# EAGLE design Crypto_plus_Flash_Adapter_NucleoF767.v2 (EAGLE 9.6.2)
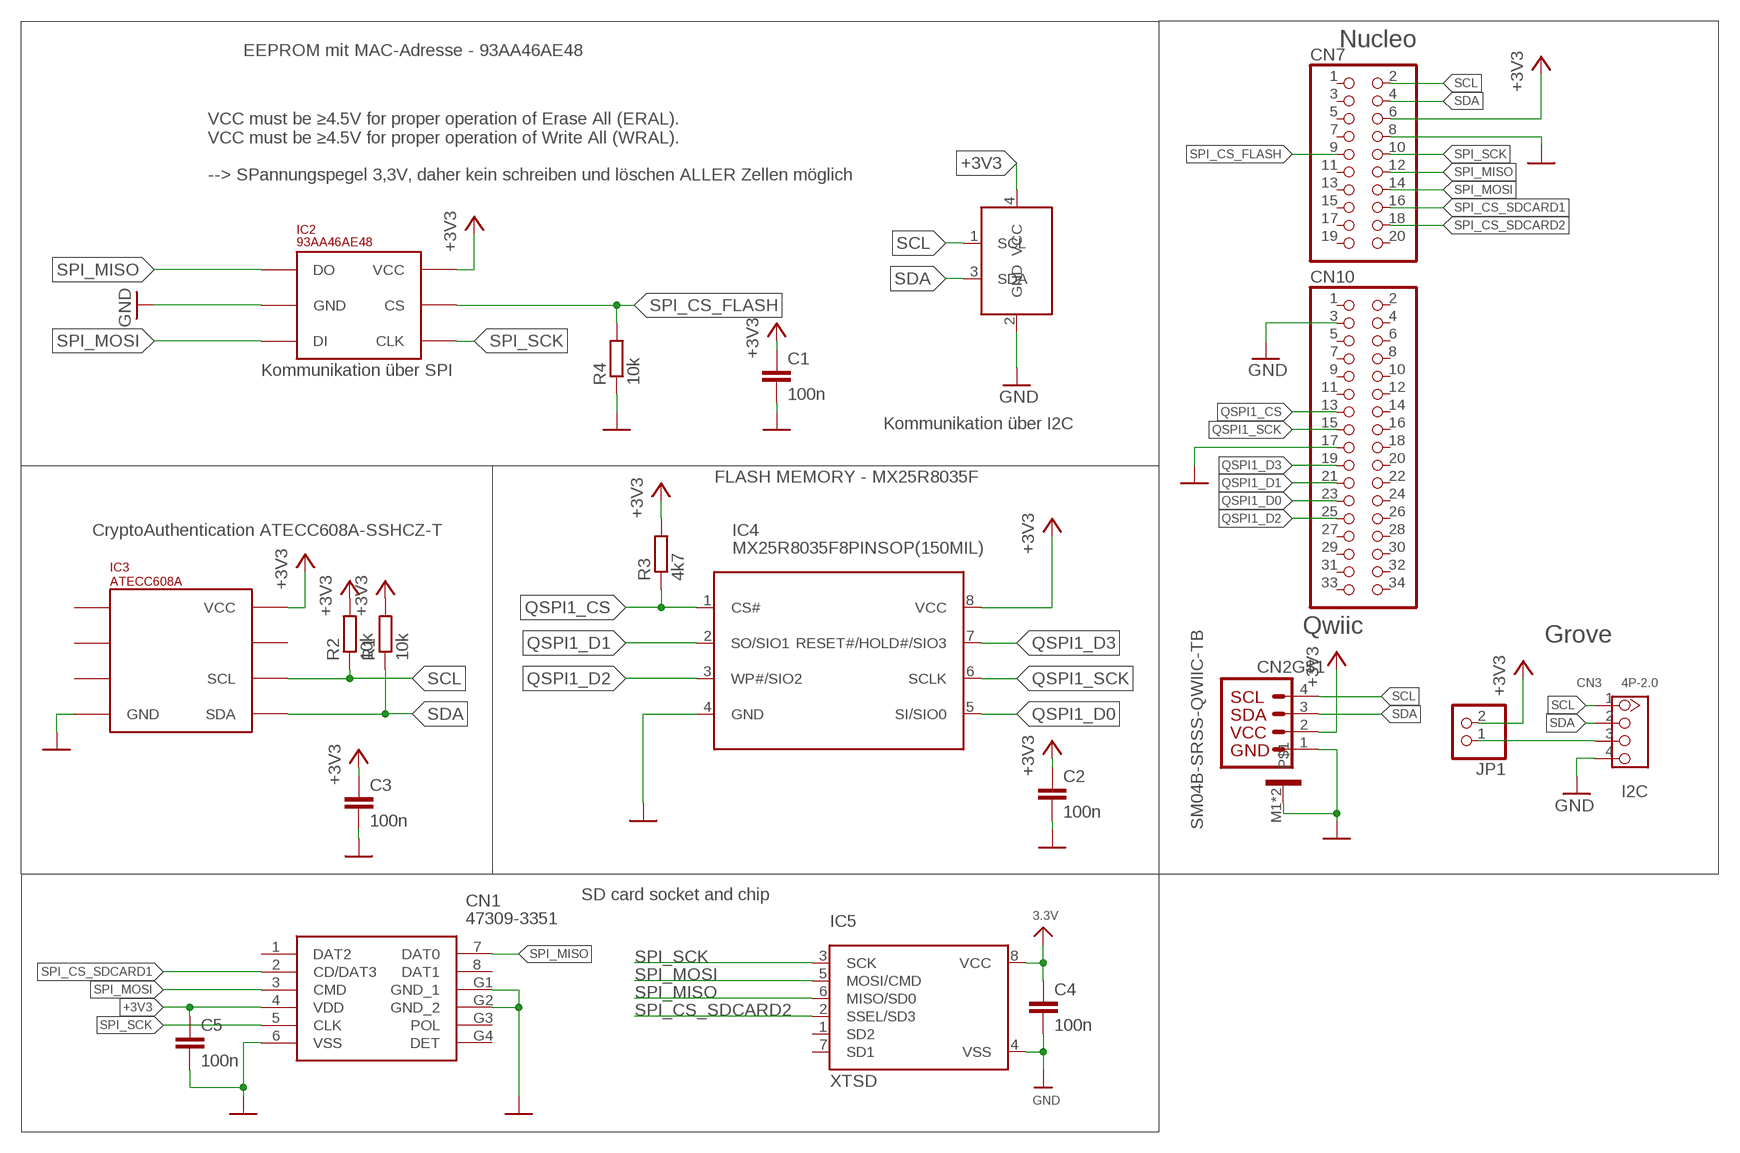
[diagram p0: schematic, sheet 1]

## Parts
C1  100n  C-EUC0603  [C0603]
C2  100n  C-EUC0603  [C0603]
C3  100n  C-EUC0603  [C0603]
C4  100n  C-EUC0603  [C0603]
C5  100n  C-EUC0603  [C0603]
CN1  47309-3351  [473093351]
CN2  SM04B-SRSS-QWIIC-TB  [SM04B-SRSS-TB]
CN3  4P-2.0  GROOVE_THT  [HW4-2.0]
CN7  PINHD-2X10  [2X10]
CN10  PINHD-2X17  [2X17]
IC1  I2CEEPROM_24AA02E48  [SOT23-5L]
IC2  93AA46AE48  [93AA46AE48]
IC3  ATECC608A  [SOIC8]
IC4  MX25R8035F8PINSOP(150MIL)  [SOIC127P600X175-8]
IC5  XTSD  SMT_SDCARD_8PIN  [LGA8_8X6]
JP1  PINHD-1X2  [1X02]
R1  10k  R-EU_R0603  [R0603]
R2  10k  R-EU_R0603  [R0603]
R3  4k7  R-EU_R0603  [R0603]
R4  10k  R-EU_R0603  [R0603]

## Nets
+3V3: C1.1 C2.1 C3.1 C4.1 C5.1 CN1.4(VDD) CN2.2 CN7.6 IC1.4(VCC) IC2.P$6(VCC) IC3.8(VCC) IC4.8(VCC) IC5.8(VCC) JP1.2 R1.2 R2.2 R3.2 ; supply symbol labelled 3.3V
GND: C1.2 C2.2 C3.2 C4.2 C5.2 CN1.6(VSS) CN1.G1(GND_1) CN1.G2(GND_2) CN2.1 CN2.M1 CN2.M2 CN3.4 CN7.8 CN10.17 IC1.2(GND) IC2.P$2(GND) IC3.4(GND) IC4.4(GND) IC5.4(VSS) R4.1
N$1: CN3.3 JP1.1
N$2: CN10.3 ; supply symbol labelled GND
QSPI1_CS: CN10.13 IC4.1(CS#) R3.1
QSPI1_D0: CN10.23 IC4.5(SI/SIO0)
QSPI1_D1: CN10.21 IC4.2(SO/SIO1)
QSPI1_D2: CN10.25 IC4.3(WP#/SIO2)
QSPI1_D3: CN10.19 IC4.7(RESET#/HOLD#/SIO3)
QSPI1_SCK: CN10.15 IC4.6(SCLK)
SCL: CN2.4 CN3.1 CN7.2 IC1.1(SCL) IC3.6(SCL) R2.1
SDA: CN2.3 CN3.2 CN7.4 IC1.3(SDA) IC3.5(SDA) R1.1
SPI_CS_FLASH: CN7.9 IC2.P$5(CS) R4.2
SPI_CS_SDCARD1: CN1.2(CD/DAT3) CN7.16
SPI_CS_SDCARD2: CN7.18 IC5.2(SSEL/SD3)
SPI_MISO: CN1.7(DAT0) CN7.12 IC2.P$1(DO) IC5.6(MISO/SD0)
SPI_MOSI: CN1.3(CMD) CN7.14 IC2.P$3(DI) IC5.5(MOSI/CMD)
SPI_SCK: CN1.5(CLK) CN7.10 IC2.P$4(CLK) IC5.3(SCK)
Unconnected: CN1.1(DAT2) CN1.8(DAT1) CN1.G3(POL) CN1.G4(DET) CN7.1 CN7.3 CN7.5 CN7.7 CN7.11 CN7.13 CN7.15 CN7.17 CN7.19 CN7.20 CN10.1 CN10.2 CN10.4 CN10.5 CN10.6 CN10.7 CN10.8 CN10.9 CN10.10 CN10.11 CN10.12 CN10.14 CN10.16 CN10.18 CN10.20 CN10.22 CN10.24 CN10.26 CN10.27 CN10.28 CN10.29 CN10.30 CN10.31 CN10.32 CN10.33 CN10.34 IC3.1(NC1) IC3.2(NC2) IC3.3(NC3) IC3.7(NC4) IC5.1(SD2) IC5.7(SD1)

## Notes on the sheet
- Nucleo
- EEPROM mit MAC-Adresse - 93AA46AE48
- VCC must be ≥4.5V for proper operation of Erase All (ERAL).
  VCC must be ≥4.5V for proper operation of Write All (WRAL).
  
  --> SPannungspegel 3,3V, daher kein schreiben und löschen ALLER Zellen möglich
- Kommunikation über SPI
- Kommunikation über I2C
- FLASH MEMORY - MX25R8035F
- CryptoAuthentication ATECC608A-SSHCZ-T
- Qwiic
- Grove
- I2C
- SD card socket and chip

## Library data of the parts
C1-C5 = rcl:C-EU: CAPACITOR, European symbol; SPICEPREFIX: C
CN1 = SamacSys_Parts:47309-3351: Molex 47309 Series 8 Way Right Angle Micro SD Memory Card Connector with Solder Termination Source: Datasheet <https://componentsearchengine.com/Datasheets/2/47309-3351.pdf>; DESCRIPTION: Molex 47309 Series 8 Way Right Angle Micro SD Memory Card Connector with Solder Termination; HEIGHT: 3.35mm; MANUFACTURER_NAME: Molex; MANUFACTURER_PART_NUMBER: 47309-3351; MOUSER_PART_NUMBER: 538-47309-3351; MOUSER_PRICE-STOCK: https://www.mouser.co.uk/ProductDetail/Molex/47309-3351/?qs=7KFxWLW3pjpf5Z6T4AnH5Q%3D%3D
CN2 = con-JST SH:SM04B-SRSS-QWIIC: JST SH series header 1.00mm pitch disconnectable crimp style connectors, horizontal (side entry type), 4 pins
CN3 = HSW_ATM-Connector:GROOVE_THT: 320110033
CN7 = pinhead:PINHD-2X10: PIN HEADER
CN10 = pinhead:PINHD-2X17: PIN HEADER
IC1 = i2c_eeprom_24AA02E48:I2CEEPROM_24AA02E48
IC2 = 93AA46AE48:93AA46AE48
IC3 = ATECC608A:ATECC608A
IC4 = MX25R8035F:MX25R8035F: MX25R8035F ULTRA LOW POWER, 8M-BIT [x 1/x 2/x 4] CMOS MXSMIO® (SERIAL MULTI I/O) FLASH MEMORY Key Features • Ultra Low Power Mode and High Performance Mode • Wide Range VCC 1.65V-3.6V for Read, Erase and Program Operations • Unique ID and Secure OTP Support • Multi I/O Support - Single I/O, Dual I/O and Quad I/O • Program Suspend/Resume & Erase Suspend/Resum Datasheet: Macronix MX25R8035F <http://www.macronix.com/Lists/Datasheet/Attachments/7461/MX25R8035F,%20Wide%20Range,%208Mb,%20v1.6.pdf> Digi-Key: MX25R8035FM2IL0 <https://www.digikey.de/product-detail/de/macronix/MX25R8035FM2IL0/1092-1205-ND/6558609>
IC5 = microbuilder:SMT_SDCARD_8PIN: SOIC8 SPI Flash Be careful with the size since SOIC8 flash comes in several 'widths' SOIC8 150 mil M25P16 - 16Mbit (2Mbit x 8) Serial Flash (75MHz SPI Bus), Supply: 2.7-3.6V Digikey: SOIC8 - M25P16-VMN6P-ND SOIC8 208 mil W25Q16BVSSIG - 16Mbit (2Mbit x 8) Serial Flash (104MHz SPI Bus), Supply: 2.7-3.6V Digikey: SOIC8 - W25Q16BVSSIG-ND
JP1 = HSW_ATM-Connector:PINHD-1X2: PIN HEADER
R1-R4 = rcl:R-EU_: RESISTOR, European symbol; SPICEPREFIX: R

## Net classes
0 Default: width 0.203 mm

## Board
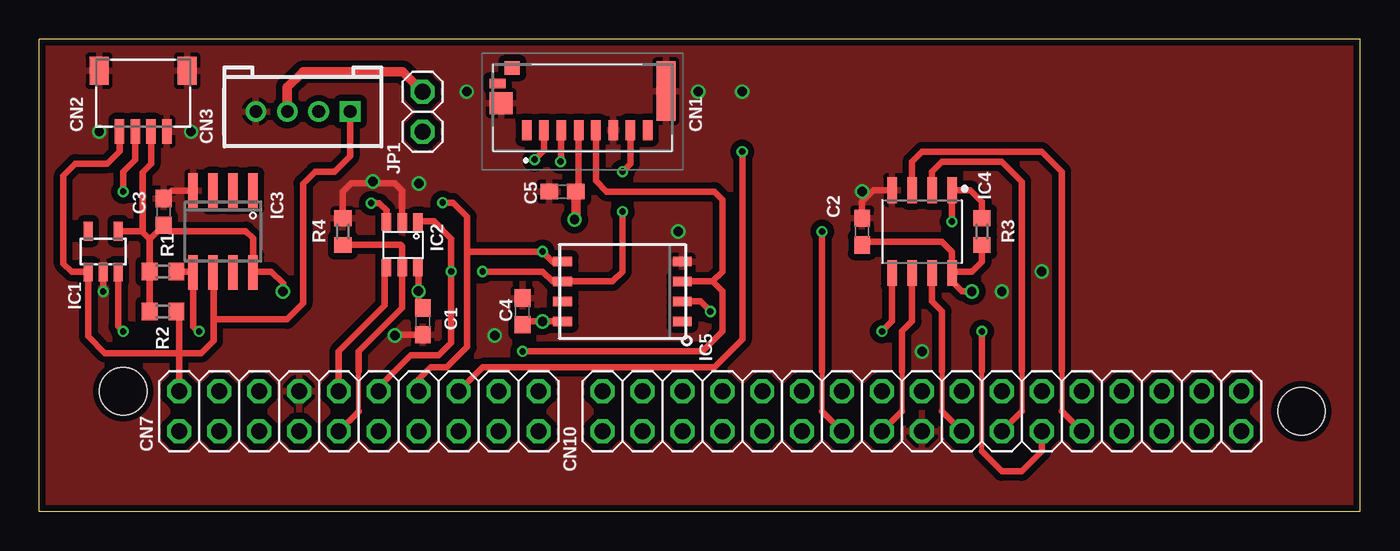
[diagram p1: board, top side]
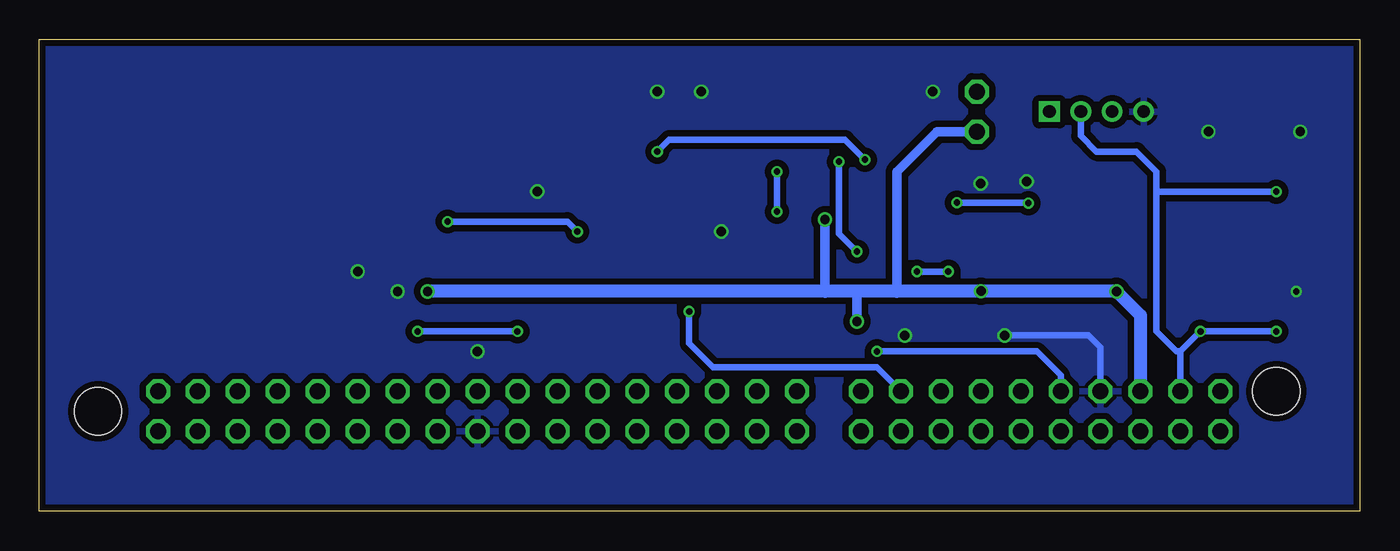
[diagram p2: board, bottom side, seen from below]

Size 84 x 30 mm. Coordinates in mm from the lower left corner, seen from the top.
Outline: 84,0 84,30 0,30 0,0 84,0
Copper layers (1+2*15+16): Top 0.035mm / dielectric 1.5mm / Route2 0.0175mm / dielectric 1.1mm / Route15 0.0175mm / dielectric 0.2mm / Bottom 0.035mm
Design rules "SeeedStudio_2layer_DRU_no_angle_20140221 *": minimum track width 6mil, minimum drill 12mil, track to track 6mil, track to pad 6mil, pad to pad 6mil, via to via 6mil, smd to smd 0mil, copper to edge 10mil, drill to drill 10mil, minimum pad ring 10mil, minimum via ring 6mil, stop-mask expansion 2mil, vias tented up to drill 100mil, thermal gap 10mil
Holes 3 mm at 5.33,7.62 80.26,6.35

### Footprints (pad centres in the part's own frame; a part is rotated, then mirrored left to right if it is on the bottom)
C0603 = smd 1.1 x 1: 1 -0.85,0; 2 0.85,0
473093351 = smd 0.6 x 1.25: 1 3.55,1.175; 2 2.45,1.175; 3 1.35,1.175; 4 0.25,1.175; 5 -0.85,1.175; 6 -1.95,1.175; 7 -3.05,1.175; 8 -4.15,1.175 | smd 1.2 x 3.79: G1 -5.3,-1.305 | smd 1.45 x 1.4: G2 5.175,-0.55 | smd 1 x 0.6: G3 5.4,-1.8 | smd 0.95 x 0.85: G4 4.475,-2.775
SM04B-SRSS-TB = smd 0.6 x 1.55: 1 1.5,0; 2 0.5,0; 3 -0.5,0; 4 -1.5,0 | smd 1.2 x 1.8: M1 2.8,3.875; M2 -2.8,3.875
HW4-2.0 = drill 0.8 pad 1.27 square: 1 -3,0 | drill 0.8 pad 1.27: 2 -1,0; 3 1,0; 4 3,0
2X10 = drill 1.016 octagon: 1 -11.43,-1.27; 2 -11.43,1.27; 3 -8.89,-1.27; 4 -8.89,1.27; 5 -6.35,-1.27; 6 -6.35,1.27; 7 -3.81,-1.27; 8 -3.81,1.27; 9 -1.27,-1.27; 10 -1.27,1.27; 11 1.27,-1.27; 12 1.27,1.27; 13 3.81,-1.27; 14 3.81,1.27; 15 6.35,-1.27; 16 6.35,1.27; 17 8.89,-1.27; 18 8.89,1.27; 19 11.43,-1.27; 20 11.43,1.27
2X17 = drill 1.016 octagon: 1 -20.32,-1.27; 2 -20.32,1.27; 3 -17.78,-1.27; 4 -17.78,1.27; 5 -15.24,-1.27; 6 -15.24,1.27; 7 -12.7,-1.27; 8 -12.7,1.27; 9 -10.16,-1.27; 10 -10.16,1.27; 11 -7.62,-1.27; 12 -7.62,1.27; 13 -5.08,-1.27; 14 -5.08,1.27; 15 -2.54,-1.27; 16 -2.54,1.27; 17 0,-1.27; 18 0,1.27; 19 2.54,-1.27; 20 2.54,1.27; 21 5.08,-1.27; 22 5.08,1.27; 23 7.62,-1.27; 24 7.62,1.27; 25 10.16,-1.27; 26 10.16,1.27; 27 12.7,-1.27; 28 12.7,1.27; 29 15.24,-1.27; 30 15.24,1.27; 31 17.78,-1.27; 32 17.78,1.27; 33 20.32,-1.27; 34 20.32,1.27
SOT23-5L = smd 0.55 x 1.2: 1 -0.95,-1.3; 2 0,-1.3; 3 0.95,-1.3; 4 0.95,1.3; 5 -0.95,1.3
93AA46AE48 = smd 0.6 x 1.1: P$1 0.3,-0.6; P$2 1.3,-0.6; P$3 2.3,-0.6; P$4 2.3,2.3; P$5 1.3,2.3; P$6 0.3,2.3
SOIC8 = smd 0.6 x 2.2: 1 -1.905,-2.6; 2 -0.635,-2.6; 3 0.635,-2.6; 4 1.905,-2.6; 5 1.905,2.6; 6 0.635,2.6; 7 -0.635,2.6; 8 -1.905,2.6
SOIC127P600X175-8 = smd 1.645 x 0.607: 1 -2.635,1.905; 2 -2.635,0.635; 3 -2.635,-0.635; 4 -2.635,-1.905; 5 2.635,-1.905; 6 2.635,-0.635; 7 2.635,0.635; 8 2.635,1.905
LGA8_8X6 = smd 1.2 x 0.6: 1 -3.8,1.905; 2 -3.8,0.635; 3 -3.8,-0.635; 4 -3.8,-1.905; 5 3.8,-1.905; 6 3.8,-0.635; 7 3.8,0.635; 8 3.8,1.905
1X02 = drill 1.016 octagon: 1 -1.27,0; 2 1.27,0
R0603 = smd 1 x 1.1: 1 -0.85,0; 2 0.85,0

### Placement (x,y rotation side)
C1  24.38,12.06 270 top
C2  52.32,17.78 90 top
C3  7.91,19.03 90 top
C4  30.73,12.7 90 top
C5  33.27,20.32 180 top
CN1  34.54,25.4 180 top
CN2  6.6,24.13 0 top
CN3  16.76,25.4 180 top
CN7  20.32,6.35 0 top
CN10  56.13,6.35 0 top
IC1  4.06,16.51 0 top
IC2  24.38,17.78 180 top
IC3  11.68,17.78 180 top
IC4  56.13,17.78 270 top
IC5  37.08,13.97 180 top
JP1  24.38,25.4 270 top
R1  7.87,15.24 180 top
R2  7.87,12.7 180 top
R3  59.94,17.78 270 top
R4  19.3,17.78 270 top

### Tracks (layer width: path | path; a pad name or v marks a point on that pad's centre or on a via)
+3V3  (via drill 0.6)
  Top 0.406: R2.2 R1.2 7.02,17.29 | 7.02,17.29 C3.1 8.28,17.81 13.13,17.81 13.59,17.36 IC3.8 13.65,15.24 14.73,15.24 15.49,14.48 v15.49,13.97 | C1.1 24.11,13.19 v24.11,13.99 24.11,15.45 IC2.P$6 | IC4.8 58.13,15.24 59.31,15.24 59.94,15.88 R3.2 | IC4.8 58.04,14.61 58.67,13.97 v59.31,13.97 | IC4.8 58.04,16.51 57.4,17.14 52.54,17.14 C2.1 | IC1.4 6.5,17.81 6.57,17.75 | 6.57,17.75 7.02,17.29 | 6.57,17.75 6.57,21.55 7.1,22.09 CN2.2 | CN1.4 34.29,20.49 C5.1 | IC5.8 v32,12.06 30.95,12.06 C4.1
  Top 0.61: C5.1 34.12,18.63 v34.04,18.54
  Bottom 0.406: v24.11,13.99 24.09,13.97 v15.49,13.97
  Bottom 0.61: JP1.2 26.92,24.13 29.46,21.59 29.46,13.97 | v34.04,18.54 34.04,13.97 | 32,13.97 v32,12.06
  Bottom 0.813: v59.31,13.97 34.04,13.97 32,13.97 29.46,13.97 v15.49,13.97 13.97,12.45 CN7.6
GND  (via drill 0.4, 0.6)
  Top 0.406: C3.2 8.41,20.38 IC3.4 | R4.1 19.3,20.32 19.82,20.84 22.6,20.84 23.08,20.36 IC2.P$2 | C2.2 52.32,19.68 53.05,20.41 IC4.4 | v22.61,11.18 22.64,11.21 C1.2 | IC1.2 v4.06,13.97
  Bottom 0.406: v22.61,11.18 17.27,11.18 16.51,10.41 CN7.8
  other vias: 21.21,20.95 52.32,20.32 63.75,15.24 61.21,13.97 56.13,10.16 40.64,17.78 44.7,26.67 27.18,26.67 28.96,11.18 9.65,24.13 3.81,24.13 24.13,20.83 41.91,26.67
  pour Top (isolate 0.406): -1,-1 -1,31 85,31 85,-1
  pour Bottom (isolate 0.406): 0,0 0,30 84,30 84,0
N$1
  Top 0.61: CN3.3 15.76,26.94 16.76,27.94 23.11,27.94 JP1.1
QSPI1_CS  (via drill 0.4)
  Top 0.305: 49.78,8.89 49.78,6.35
  Top 0.406: R3.1 59.94,19.68 59.21,20.41 IC4.1 v58.04,18.41 | v49.78,17.78 49.78,8.89 | 49.78,6.35 CN10.13
  Bottom 0.406: v49.78,17.78 50.42,18.41 v58.04,18.41
QSPI1_D0  (via drill 0.4)
  Top 0.305: 59.94,3.81 59.94,8.89
  Top 0.406: 59.94,3.81 61.21,2.54 62.48,2.54 63.75,3.81 CN10.23 | 59.94,8.89 v59.94,11.43 | v53.59,11.43 54.23,12.06 IC4.5
  Bottom 0.406: v59.94,11.43 v53.59,11.43
QSPI1_D1
  Top 0.305: 62.48,8.89 62.48,6.35
  Top 0.406: IC4.2 56.77,21.59 57.4,22.23 61.21,22.23 62.48,20.95 62.48,8.89 | 62.48,6.35 CN10.21
QSPI1_D2
  Top 0.305: 65.02,8.89 65.02,6.35
  Top 0.406: 65.02,8.89 65.02,21.59 63.75,22.86 56.13,22.86 55.5,22.23 IC4.3 | 65.02,6.35 CN10.25
QSPI1_D3
  Top 0.305: 57.4,8.89 57.4,6.35
  Top 0.406: 57.4,8.89 57.4,12.7 56.77,13.34 IC4.7 | 57.4,6.35 CN10.19
QSPI1_SCK
  Top 0.305: 54.86,8.89 54.86,6.35
  Top 0.406: 54.86,8.89 54.86,11.43 55.5,12.06 IC4.6 | 54.86,6.35 CN10.15
SCL
  Top 0.406: 11.08,12.19 11.08,10.83 10.31,10.05 8.89,10.05 | 11.08,12.19 11.08,15.14 IC3.6 | 8.89,10.05 4.17,10.05 3.11,11.11 IC1.1 2.06,15.21 1.52,15.75 1.52,21.34 2.29,22.1 4.32,22.1 5.1,22.88 CN2.4 | 8.89,10.05 8.89,12.53 R2.1 | CN3.1 19.76,22.56 18.8,21.59 17.53,21.59 16.76,20.83 16.76,13.21 15.75,12.19 11.08,12.19 | CN7.2 8.89,10.05
SDA  (via drill 0.4)
  Top 0.406: R1.1 9.72,15.24 IC3.5 9.78,11.72 10.07,11.43 v10.16,11.43 | IC1.3 5.01,11.75 v5.33,11.43 | v5.33,20.32 5.33,21.59 6.1,22.36 CN2.3
  Bottom 0.406: 11.43,10.16 v10.16,11.43 v5.33,11.43 | CN3.2 17.76,23.86 16.76,22.86 14.22,22.86 12.95,21.59 12.95,20.32 | 12.95,20.32 12.95,11.43 11.68,10.16 11.43,10.16 | 12.95,20.32 v5.33,20.32 | CN7.4 11.43,10.16
SPI_CS_FLASH
  Top 0.305: 20.3,6.35 20.3,8.91
  Top 0.406: 20.3,8.91 20.3,10.16 23.08,12.94 IC2.P$5 23.08,16.82 22.97,16.93 R4.2 | CN7.9 20.3,6.33 20.3,6.35
SPI_CS_SDCARD1  (via drill 0.4)
  Top 0.406: CN1.2 32.09,22.95 v31.5,22.35 | v44.7,22.86 44.7,10.92 42.93,9.14 28.19,9.14 CN7.16
  Bottom 0.406: v31.5,22.35 32.77,23.62 43.94,23.62 v44.7,22.86
SPI_CS_SDCARD2  (via drill 0.4)
  Top 0.406: IC5.2 42.04,13.34 v42.67,12.7
  Bottom 0.406: v42.67,12.7 42.67,10.67 41.15,9.14 30.73,9.14 CN7.18
SPI_MISO  (via drill 0.4)
  Top 0.406: IC2.P$1 24.13,18.43 25.09,18.43 26.2,17.33 v26.2,15.24 26.2,10.7 25.4,9.91 23.62,9.91 21.59,7.87 CN7.12 | v37.08,19.05 37.08,15.24 36.45,14.61 IC5.6 32.64,14.61 32,15.24 v28.19,15.24 | CN1.7 37.59,22.1 v37.08,21.59
  Bottom 0.406: v37.08,19.05 v37.08,21.59 | v28.19,15.24 v26.2,15.24
SPI_MOSI  (via drill 0.4)
  Top 0.406: v25.64,19.62 26.3,19.62 27.21,18.72 27.21,16.51 | v21.1,19.59 21.62,19.59 22.08,19.13 IC2.P$3 | 27.21,16.51 27.21,10.44 25.91,9.14 24.89,9.14 24.13,8.38 CN7.14 | IC5.5 32.64,15.88 v32,16.51 27.21,16.51 | CN1.3 33.19,22.27 v33.15,22.23
  Bottom 0.406: v25.64,19.62 21.11,19.62 21.1,19.61 v21.1,19.59 | v33.15,22.23 33.15,17.65 v32,16.51
SPI_SCK  (via drill 0.4)
  Top 0.406: IC2.P$4 22.08,15.45 21.97,15.34 21.97,13.08 19.05,10.16 CN7.10 | IC5.3 42.8,14.61 | 42.8,14.61 43.43,15.24 43.43,19.81 42.93,20.32 36.07,20.32 35.39,20.99 CN1.5 | 42.8,14.61 43.43,13.97 43.43,11.43 42.16,10.16 v30.73,10.16
  Bottom 0.406: v30.73,10.16 20.57,10.16 19.05,8.64 CN7.10

### Text on the board
tDocu: Grove 3.3V/5V | QWIIC | Grove | Crypto+ / MacEEPROM+ / Flash+ / SD Card / 210131